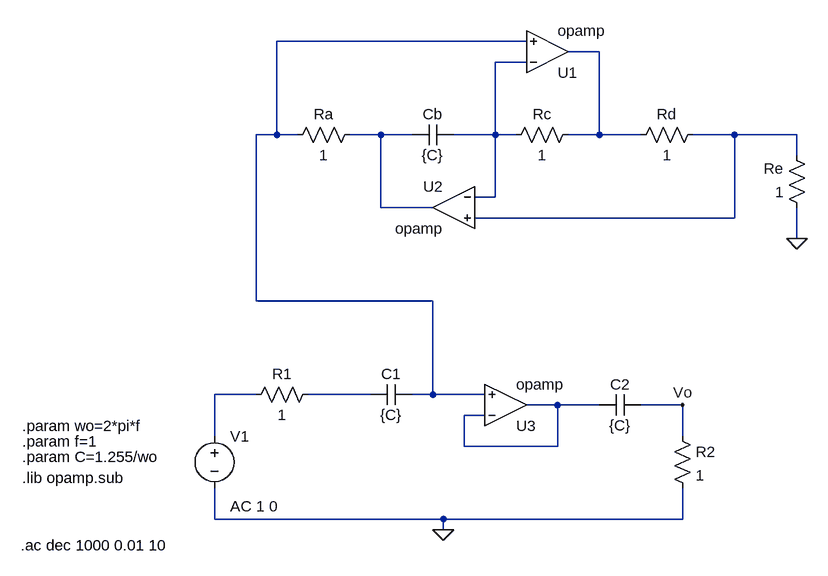
[diagram p0: schematic TS4_activo.asc]
TS4_activo.asc, the LTspice schematic file:
Version 4
SHEET 1 948 680
WIRE 448 -400 64 -400
WIRE 560 -384 512 -384
WIRE 448 -368 400 -368
WIRE 64 -256 64 -400
WIRE 64 -256 32 -256
WIRE 96 -256 64 -256
WIRE 224 -256 176 -256
WIRE 272 -256 224 -256
WIRE 400 -256 400 -368
WIRE 400 -256 336 -256
WIRE 432 -256 400 -256
WIRE 560 -256 560 -384
WIRE 560 -256 512 -256
WIRE 624 -256 560 -256
WIRE 768 -256 704 -256
WIRE 864 -256 768 -256
WIRE 864 -224 864 -256
WIRE 400 -160 400 -256
WIRE 400 -160 368 -160
WIRE 224 -144 224 -256
WIRE 304 -144 224 -144
WIRE 768 -128 768 -256
WIRE 768 -128 368 -128
WIRE 864 -96 864 -144
WIRE 32 0 32 -256
WIRE 304 0 32 0
WIRE 32 144 -32 144
WIRE 208 144 112 144
WIRE 304 144 304 0
WIRE 304 144 272 144
WIRE 384 144 304 144
WIRE 496 160 448 160
WIRE 560 160 496 160
WIRE 688 160 624 160
WIRE 384 176 352 176
WIRE -32 208 -32 144
WIRE 688 208 688 160
WIRE 352 224 352 176
WIRE 496 224 496 160
WIRE 496 224 352 224
WIRE -32 336 -32 288
WIRE 320 336 -32 336
WIRE 688 336 688 288
WIRE 688 336 320 336
WIRE 320 352 320 336
FLAG 864 -96 0
FLAG 320 352 0
FLAG 688 160 Vo
SYMBOL res 128 128 R90
WINDOW 0 0 56 VBottom 2
WINDOW 3 32 56 VTop 2
SYMATTR InstName R1
SYMATTR Value 1
SYMBOL cap 272 128 R90
WINDOW 0 0 32 VBottom 2
WINDOW 3 32 32 VTop 2
SYMATTR InstName C1
SYMATTR Value {C}
SYMBOL cap 624 144 R90
WINDOW 0 0 32 VBottom 2
WINDOW 3 32 32 VTop 2
SYMATTR InstName C2
SYMATTR Value {C}
SYMBOL res 672 192 R0
SYMATTR InstName R2
SYMATTR Value 1
SYMBOL res 192 -272 R90
WINDOW 0 0 56 VBottom 2
WINDOW 3 32 56 VTop 2
SYMATTR InstName Ra
SYMATTR Value 1
SYMBOL res 528 -272 R90
WINDOW 0 0 56 VBottom 2
WINDOW 3 32 56 VTop 2
SYMATTR InstName Rc
SYMATTR Value 1
SYMBOL res 720 -272 R90
WINDOW 0 0 56 VBottom 2
WINDOW 3 32 56 VTop 2
SYMATTR InstName Rd
SYMATTR Value 1
SYMBOL res 880 -128 R180
WINDOW 0 36 76 Left 2
WINDOW 3 36 40 Left 2
SYMATTR InstName Re
SYMATTR Value 1
SYMBOL cap 336 -272 R90
WINDOW 0 0 32 VBottom 2
WINDOW 3 32 32 VTop 2
SYMATTR InstName Cb
SYMATTR Value {C}
SYMBOL OpAmps\\opamp 480 -320 M180
SYMATTR InstName U1
SYMBOL OpAmps\\opamp 336 -208 M0
SYMATTR InstName U2
SYMBOL OpAmps\\opamp 416 224 M180
SYMATTR InstName U3
SYMBOL voltage -32 192 R0
WINDOW 123 24 124 Left 2
WINDOW 39 0 0 Left 0
SYMATTR InstName V1
SYMATTR Value ""
SYMATTR Value2 AC 1 0
TEXT -328 216 Left 2 !.param f=1
TEXT -328 240 Left 2 !.param C=1.255/wo
TEXT -328 272 Left 2 !.lib opamp.sub
TEXT -330 376 Left 2 !.ac dec 1000 0.01 10
TEXT -328 192 Left 2 !.param wo=2*pi*f

The netlist it stands for:
* TS4_activo.asc
R1 N007 N006 1
C1 N001 N007 {C}
C2 Vo N008 {C}
R2 Vo 0 1
Ra N004 N001 1
Rc N002 N003 1
Rd N005 N002 1
Re 0 N005 1
Cb N003 N004 {C}
XU1 N003 N001 N002 opamp Aol=100K GBW=10Meg  ; pins invin noninvin out
XU2 N003 N005 N004 opamp Aol=100K GBW=10Meg  ; pins invin noninvin out
XU3 N008 N001 N008 opamp Aol=100K GBW=10Meg  ; pins invin noninvin out
V1 N006 0 AC 1 0
.param f=1
.param C=1.255/wo
.lib opamp.sub
.ac dec 1000 0.01 10
.param wo=2*pi*f
.backanno
.end